# EAGLE design blender (EAGLE 7.2.0)
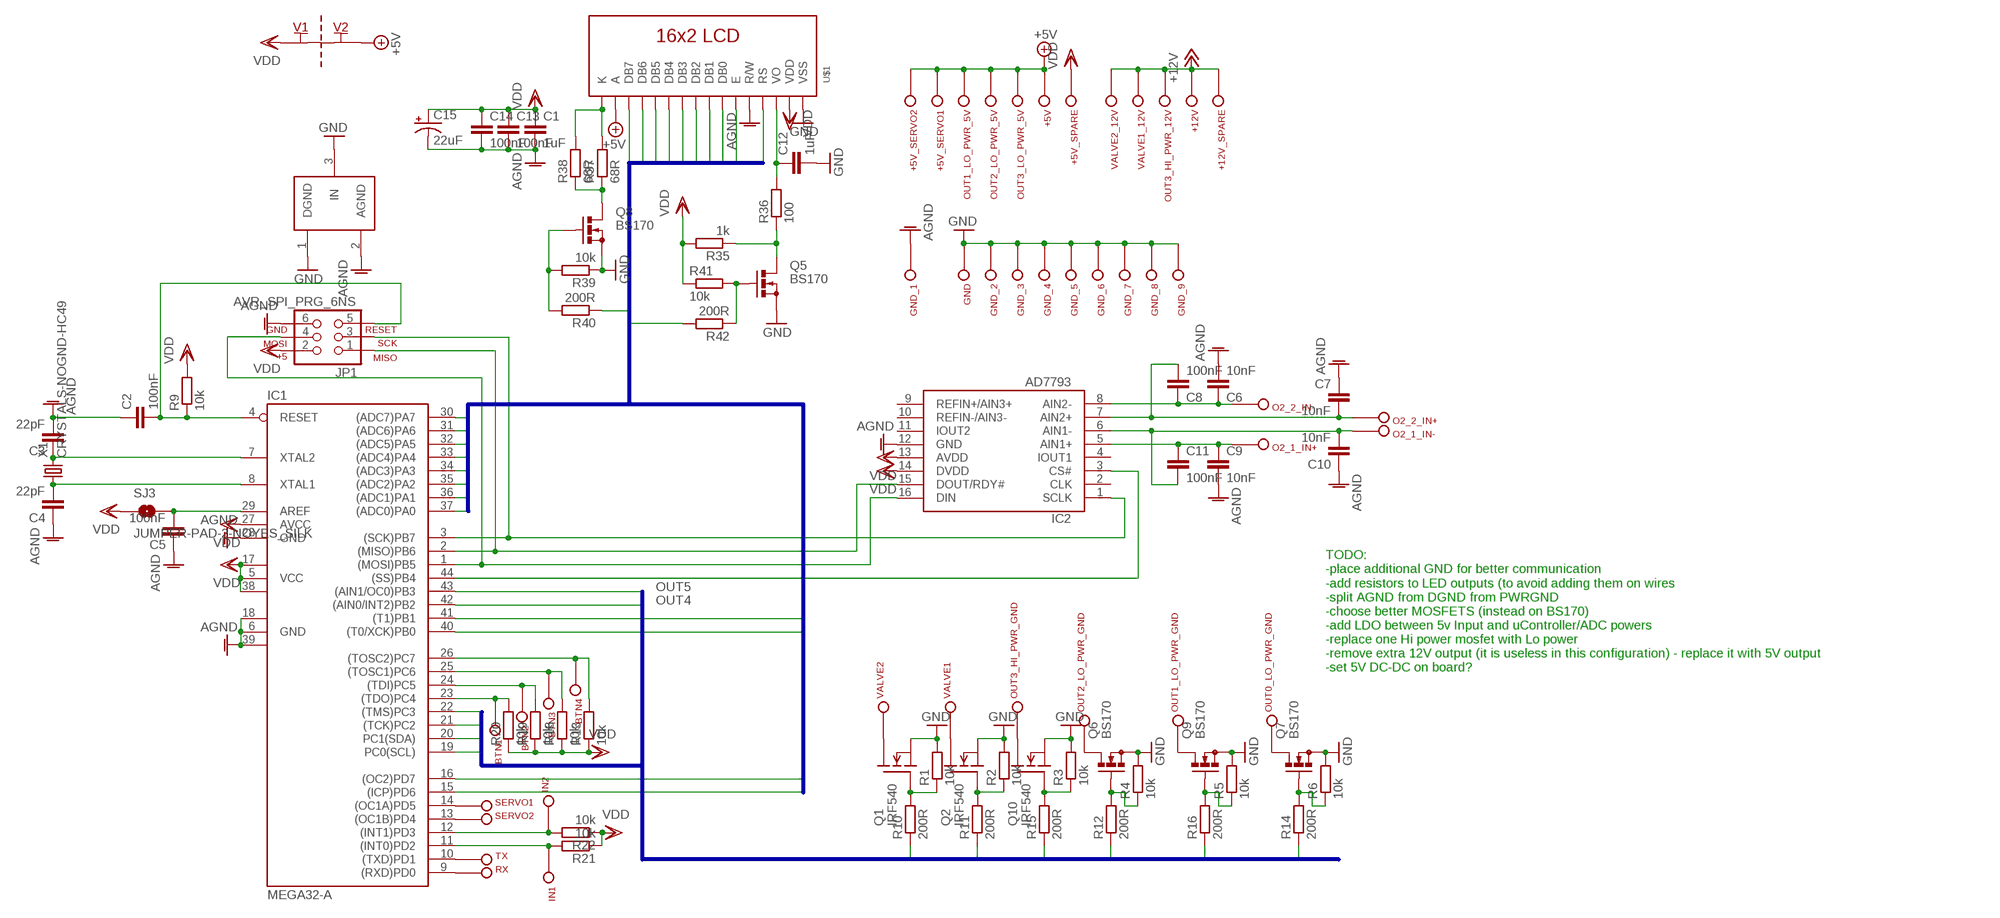
[diagram p0: schematic, sheet 1]

## Parts
+5V  PIN  [PIN]
+5V_SERVO1  PIN  [PIN]
+5V_SERVO2  PIN  [PIN]
+5V_SPARE  PIN  [PIN]
+12V  PIN  [PIN]
+12V_SPARE  PIN  [PIN]
BTN1  PIN  [PIN]
BTN2  PIN  [PIN]
BTN3  PIN  [PIN]
BTN4  PIN  [PIN]
C1  1uF  C-EUC0603  [C0603]
C2  100nF  C-EUC0603  [C0603]
C3  22pF  C-EUC0603  [C0603]
C4  22pF  C-EUC0603  [C0603]
C5  100nF  C-EUC0603  [C0603]
C6  10nF  C-EUC0603  [C0603]
C7  10nF  C-EUC0603  [C0603]
C8  100nF  C-EUC0603  [C0603]
C9  10nF  C-EUC0603  [C0603]
C10  10nF  C-EUC0603  [C0603]
C11  100nF  C-EUC0603  [C0603]
C12  1uF  C-EUC0603  [C0603]
C13  100nF  C-EUC0603  [C0603]
C14  100nF  C-EUC0603  [C0603]
C15  22uF  CAP_POL7343  [EIA7343]
GND  PIN  [PIN]
GND_1  PIN  [PIN]
GND_2  PIN  [PIN]
GND_3  PIN  [PIN]
GND_4  PIN  [PIN]
GND_5  PIN  [PIN]
GND_6  PIN  [PIN]
GND_7  PIN  [PIN]
GND_8  PIN  [PIN]
GND_9  PIN  [PIN]
IC1  MEGA32-A  [TQFP44]
IC2  AD7793  [TSSOP16]
IN1  PIN  [PIN]
IN2  PIN  [PIN]
JP1  AVR_SPI_PRG_6NS  [2X3-NS]
O2_1_IN+  PIN  [PIN]
O2_1_IN-  PIN  [PIN]
O2_2_IN+  PIN  [PIN]
O2_2_IN-  PIN  [PIN]
OUT0_LO_PWR_GND  PIN  [PIN]
OUT1_LO_PWR_5V  PIN  [PIN]
OUT1_LO_PWR_GND  PIN  [PIN]
OUT2_LO_PWR_5V  PIN  [PIN]
OUT2_LO_PWR_GND  PIN  [PIN]
OUT3_HI_PWR_12V  PIN  [PIN]
OUT3_HI_PWR_GND  PIN  [PIN]
OUT3_LO_PWR_5V  PIN  [PIN]
Q1  IRF540  [TO220]
Q2  IRF540  [TO220]
Q5  BS170  [SOT54E]
Q6  BS170  [SOT54E]
Q7  BS170  [SOT54E]
Q8  BS170  [SOT54E]
Q9  BS170  [SOT54E]
Q10  IRF540  [TO220]
R1  10k  R-EU_R0603  [R0603]
R2  10k  R-EU_R0603  [R0603]
R3  10k  R-EU_R0603  [R0603]
R4  10k  R-EU_R0603  [R0603]
R5  10k  R-EU_R0603  [R0603]
R6  10k  R-EU_R0603  [R0603]
R9  10k  R-EU_R0603  [R0603]
R10  200R  R-EU_R0603  [R0603]
R11  200R  R-EU_R0603  [R0603]
R12  200R  R-EU_R0603  [R0603]
R13  10k  R-EU_R0603  [R0603]
R14  200R  R-EU_R0603  [R0603]
R15  200R  R-EU_R0603  [R0603]
R16  200R  R-EU_R0603  [R0603]
R18  10k  R-EU_R0603  [R0603]
R19  10k  R-EU_R0603  [R0603]
R20  10k  R-EU_R0603  [R0603]
R21  10k  R-EU_R0603  [R0603]
R22  10k  R-EU_R0603  [R0603]
R35  1k  R-EU_R0603  [R0603]
R36  100  R-EU_R0603  [R0603]
R37  68R  R-EU_R1206  [R1206]
R38  68R  R-EU_R1206  [R1206]
R39  10k  R-EU_R0603  [R0603]
R40  200R  R-EU_R0603  [R0603]
R41  10k  R-EU_R0603  [R0603]
R42  200R  R-EU_R0603  [R0603]
RX  PIN  [PIN]
SERVO1  PIN  [PIN]
SERVO2  PIN  [PIN]
SJ3  JUMPER-PAD-2-NOYES_SILK  [PAD-JUMPER-2-NO_YES_SILK]
TX  PIN  [PIN]
U$1  1602L  [1602L]
U$2  SUPPLY_CONNECT  [2PT_GND_TIE]
U$3  GND_CONNECT  [GND_CONNECT]
VALVE1  PIN  [PIN]
VALVE1_12V  PIN  [PIN]
VALVE2  PIN  [PIN]
VALVE2_12V  PIN  [PIN]
X1  CRYSTALS-NOGND-HC49  [HC49]

## Nets
+5V [PWR_5V]: +5V.P$1(P) +5V_SERVO1.P$1(P) +5V_SERVO2.P$1(P) OUT1_LO_PWR_5V.P$1(P) OUT2_LO_PWR_5V.P$1(P) OUT3_LO_PWR_5V.P$1(P) U$1.P$15(A) U$2.P$2
+12V [PWR_12V]: +12V.P$1(P) +12V_SPARE.P$1(P) OUT3_HI_PWR_12V.P$1(P) VALVE1_12V.P$1(P) VALVE2_12V.P$1(P)
AGND [PWR]: C1.2 C2.1 C3.2 C4.1 C5.1 C6.2 C7.1 C9.2 C10.1 C13.2 C14.2 C15.C(-) GND_1.P$1(P) IC1.6(GND) IC1.18(GND1) IC1.28(GND) IC1.39(GND2) IC2.12(GND) JP1.6 U$1.P$5(R/W) U$3.2(AGND)
BACKLIGHT: IC1.16((OC2)PD7) R40.1
CONTRAST: IC1.15((ICP)PD6) R42.2
DB0: IC1.37((ADC0)PA0) U$1.P$7(DB0)
DB1: IC1.36((ADC1)PA1) U$1.P$8(DB1)
DB2: IC1.35((ADC2)PA2) U$1.P$9(DB2)
DB3: IC1.34((ADC3)PA3) U$1.P$10(DB3)
DB4: IC1.33((ADC4)PA4) U$1.P$11(DB4)
DB5: IC1.32((ADC5)PA5) U$1.P$12(DB5)
DB6: IC1.31((ADC6)PA6) U$1.P$13(DB6)
DB7: IC1.30((ADC7)PA7) U$1.P$14(DB7)
E: IC1.40((T0/XCK)PB0) U$1.P$6(E)
GND [PWR_5V]: C12.2 GND.P$1(P) GND_2.P$1(P) GND_3.P$1(P) GND_4.P$1(P) GND_5.P$1(P) GND_6.P$1(P) GND_7.P$1(P) GND_8.P$1(P) GND_9.P$1(P) Q1.3(S) Q2.3(S) Q5.S Q6.S Q7.S Q8.S Q9.S Q10.3(S) R1.2 R2.2 R3.2 R4.2 R5.2 R6.2 R39.1 U$1.P$1(VSS) U$3.1(DGND) U$3.3(IN)
N$4: Q5.D R35.1 R36.1
N$5: C12.1 R36.2 U$1.P$3(VO)
N$6: Q8.D R37.1 R38.1
N$7: R37.2 R38.2 U$1.P$16(K)
N$8: Q8.G R39.2 R40.2
N$12: IC1.1((MOSI)PB5) IC2.16(DIN) JP1.4
N$13: IC1.2((MISO)PB6) IC2.15(DOUT/RDY#) JP1.1
N$14: IC1.3((SCK)PB7) IC2.1(SCLK) JP1.3
N$15: IC1.44((SS)PB4) IC2.3(CS#)
N$23: C2.2 IC1.4(RESET) JP1.5 R9.1
N$24: Q5.G R41.2 R42.1
N$25: C3.1 IC1.7(XTAL2) X1.2
N$26: C4.2 IC1.8(XTAL1) X1.1
N$27: Q1.1(G) R1.1 R10.2
N$28: Q2.1(G) R2.1 R11.2
N$29: Q10.1(G) R3.1 R15.2
N$30: BTN3.P$1(P) IC1.25((TOSC1)PC6) R18.2
N$31: Q7.G R6.1 R14.2
N$32: Q6.G R4.1 R12.2
N$33: Q9.G R5.1 R16.2
N$39: C5.2 IC1.29(AREF) SJ3.2
N$40: IC1.12((INT1)PD3) IN2.P$1(P) R22.2
N$41: IC1.11((INT0)PD2) IN1.P$1(P) R21.2
N$42: BTN4.P$1(P) IC1.26((TOSC2)PC7) R13.2
N$43: BTN2.P$1(P) IC1.24((TDI)PC5) R19.2
N$44: BTN1.P$1(P) IC1.23((TDO)PC4) R20.2
N$45: IC1.9((RXD)PD0) RX.P$1(P)
N$46: IC1.10((TXD)PD1) TX.P$1(P)
N$47: IC1.14((OC1A)PD5) SERVO1.P$1(P)
N$48: IC1.13((OC1B)PD4) SERVO2.P$1(P)
N$49 [PWR_12V]: Q2.2(D) VALVE1.P$1(P)
N$50 [PWR_12V]: Q1.2(D) VALVE2.P$1(P)
N$51 [PWR_12V]: OUT3_HI_PWR_GND.P$1(P) Q10.2(D)
N$52: OUT0_LO_PWR_GND.P$1(P) Q7.D
N$53: OUT1_LO_PWR_GND.P$1(P) Q9.D
N$54: OUT2_LO_PWR_GND.P$1(P) Q6.D
N$55: C10.2 C11.2 IC2.6(AIN1-) O2_1_IN-.P$1(P)
N$59: C7.2 C8.2 IC2.7(AIN2+) O2_2_IN+.P$1(P)
N$60: C6.1 C8.1 IC2.8(AIN2-) O2_2_IN-.P$1(P)
N$64: C9.1 C11.1 IC2.5(AIN1+) O2_1_IN+.P$1(P)
OUT0: IC1.19(PC0(SCL)) R14.1
OUT1: IC1.20(PC1(SDA)) R16.1
OUT2: IC1.21((TCK)PC2) R12.1
OUT3: IC1.22((TMS)PC3) R15.1
OUT4: IC1.42((AIN0/INT2)PB2) R11.1
OUT5: IC1.43((AIN1/OC0)PB3) R10.1
RS: IC1.41((T1)PB1) U$1.P$4(RS)
VDD [PWR]: +5V_SPARE.P$1(P) C1.1 C13.1 C14.1 C15.A(+) IC1.5(VCC) IC1.17(VCC1) IC1.27(AVCC) IC1.38(VCC2) IC2.13(AVDD) IC2.14(DVDD) JP1.2 R9.2 R13.1 R18.1 R19.1 R20.1 R21.1 R22.1 R35.2 R41.1 SJ3.1 U$1.P$2(VDD) U$2.P$1
Unconnected: IC2.2(CLK) IC2.4(IOUT1) IC2.9(REFIN+/AIN3+) IC2.10(REFIN-/AIN3-) IC2.11(IOUT2)

## Buses
DB[0..7],E,RS,BACKLIGHT,CONTRAST
OUT[0..5]

## Notes on the sheet
- TODO:
  -place additional GND for better communication
  -add resistors to LED outputs (to avoid adding them on wires
  -split AGND from DGND from PWRGND
  -choose better MOSFETS (instead on BS170)
  -add LDO between 5v Input and uController/ADC powers
  -replace one Hi power mosfet with Lo power
  -remove extra 12V output (it is useless in this configuration) - replace it with 5V output
  -set 5V DC-DC on board?

## Library data of the parts
+5V +5V_SERVO1 +5V_SERVO2 +5V_SPARE +12V +12V_SPARE BTN1-BTN4 GND GND_1-GND_9 IN1 IN2 O2_1_IN+ O2_1_IN- O2_2_IN+ O2_2_IN- OUT0_LO_PWR_GND OUT1_LO_PWR_5V OUT1_LO_PWR_GND OUT2_LO_PWR_5V OUT2_LO_PWR_GND OUT3_HI_PWR_12V OUT3_HI_PWR_GND OUT3_LO_PWR_5V RX SERVO1 SERVO2 TX VALVE1 VALVE1_12V VALVE2 VALVE2_12V = pin:PIN
C1-C14 = resistor:C-EU: CAPACITOR, European symbol
C15 = SparkFun-Capacitors:CAP_POL: Capacitor Polarized These are standard SMD and PTH capacitors. Normally 10uF, 47uF, and 100uF in electrolytic and tantalum varieties. Always verify the external diameter of the through hole cap, it varies with capacity, voltage, and manufacturer. The EIA devices should be standard.; PROD_ID: CAP-08702
IC1 = atmel:MEGA32: MICROCONTROLLER 32 Kbytes FLASH 2 Kbytes SRAM 1 Kbytes EEPROM USART 8-channel 10 bit ADC Source: www.atmel.com .. doc2503.pdf; MPN: ATMEGA32-16AU; OC_FARNELL: 9171274; OC_NEWARK: 69K6677
IC2 = ad:AD7793: 3-Channel, Low Noise, Low Power, 24-Bit Sigma-Delta ADC with On-Chip In-Amp and Reference
JP1 = SparkFun-Connectors:AVR_SPI_PRG_6: AVR ISP 6 Pin This is the reduced ISP connector for AVR programming. Common on Arduino. This footprint will take up less PCB space and can be used with a 10-pin to 6-pin adapter such as SKU: BOB-08508 **Special note about "TEST_POINT" package. The stop mask is on the top side, so if you want your programming test points to be on the bottom of your board, make sure to place this package on the bottom side of the board. This also ensure that the orientation to program from the bottom side will be correct.
Q1 Q2 Q10 = transistor-fet:IRF540: N-Channel Enhancement MOSFET (HEXFET); 100V; 28A; 0,077Ohm
Q5-Q9 = transistor-small-signal:BS170: N-CHANNEL MOS FET
R1-R6 R9-R16 R18-R22 R35-R42 = resistor:R-EU_: RESISTOR, European symbol
SJ3 = SparkFun-Passives:JUMPER-PAD-2-NO
U$1 = 1602:1602L
U$2 = SparkFun-Passives:SUPPLY_CONNECT
U$3 = SparkFun-Passives:GND_CONNECT: Use to make a connection of multiple grounds in only one place.
X1 = IQD-Frequency-Products:CRYSTALS-NOGND: CRYSTALS CAN NOT GROUNDED

## Net classes
1 PWR_5V: width 1.5 mm, drill 1 mm
2 PWR_12V: width 2 mm, drill 1 mm
3 PWR: width 0.4 mm, drill 0.6 mm

## Board
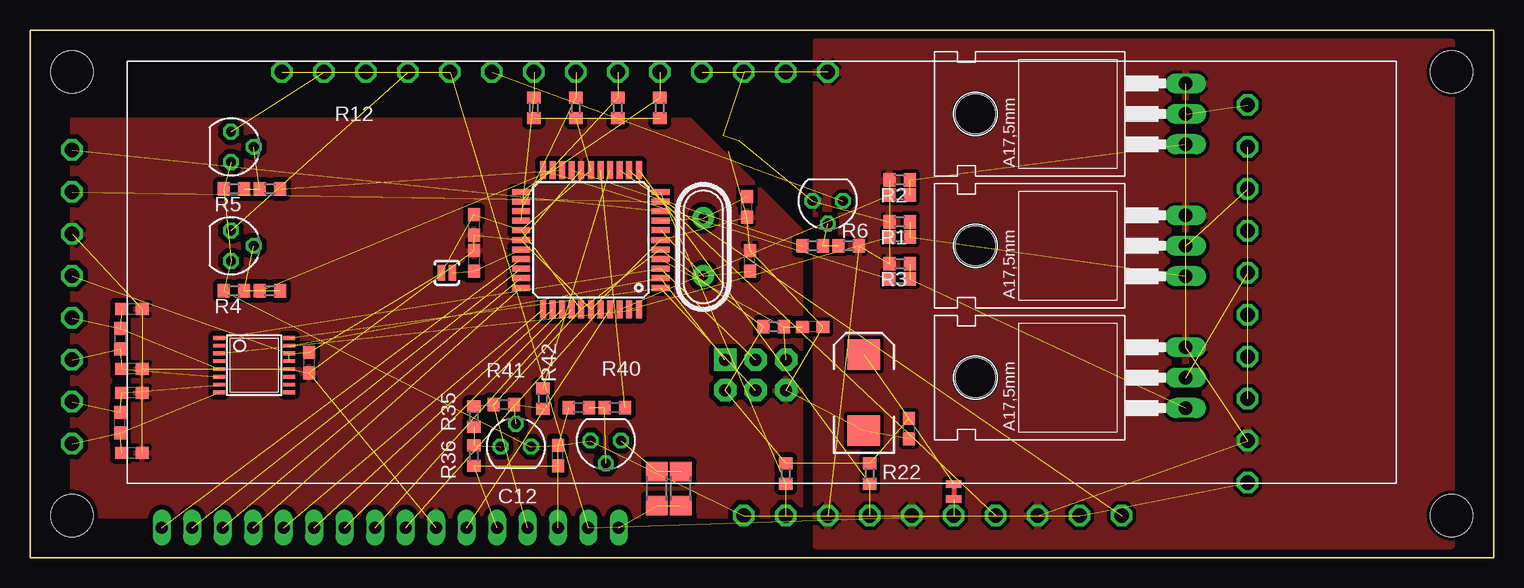
[diagram p1: board, top side]
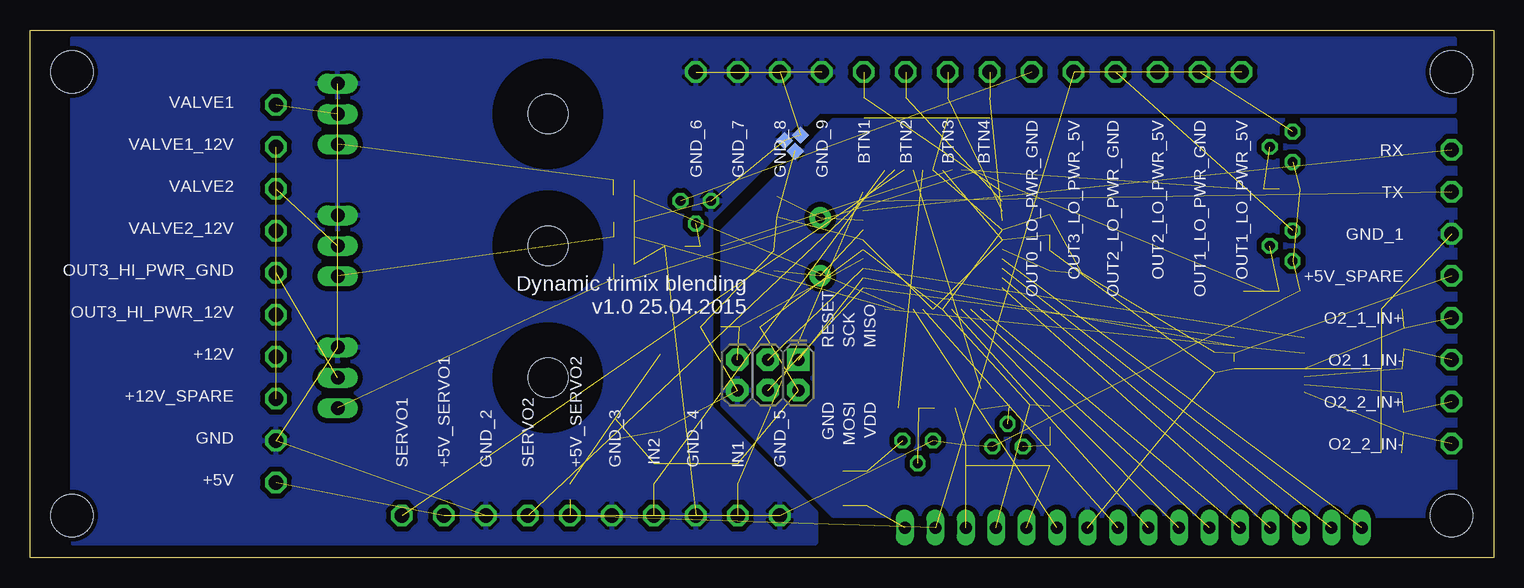
[diagram p2: board, bottom side, seen from below]

Size 122 x 44 mm. Coordinates in mm from the lower left corner, seen from the top.
Outline: 0,0 122,0 122,44 0,44 0,0
Copper layers (1*16): Top 0.035mm / dielectric 1.5mm / Bottom 0.035mm
Design rules "SeeedStudio_2layer_DRU_no_angle_20140221": minimum track width 6mil, minimum drill 12mil, track to track 6mil, track to pad 6mil, pad to pad 6mil, via to via 6mil, smd to smd 0mil, copper to edge 10mil, drill to drill 10mil, minimum pad ring 10mil, minimum via ring 6mil, stop-mask expansion 2mil, vias tented up to drill 100mil, thermal gap 10mil

### Footprints (pad centres in the part's own frame; a part is rotated, then mirrored left to right if it is on the bottom)
PIN = drill 1.2 pad 1.676 octagon: P$1 0,0
C0603 = smd 1.1 x 1: 1 -0.85,0; 2 0.85,0
EIA7343 = smd 2.55 x 2.7: A 3.17,0; C -3.17,0
TQFP44 = smd 1.5 x 0.5: 1 -5.8,4; 2 -5.8,3.2; 3 -5.8,2.4; 4 -5.8,1.6; 5 -5.8,0.8; 6 -5.8,0; 7 -5.8,-0.8; 8 -5.8,-1.6; 9 -5.8,-2.4; 10 -5.8,-3.2; 11 -5.8,-4; 23 5.8,-4; 24 5.8,-3.2; 25 5.8,-2.4; 26 5.8,-1.6; 27 5.8,-0.8; 28 5.8,0; 29 5.8,0.8; 30 5.8,1.6; 31 5.8,2.4; 32 5.8,3.2; 33 5.8,4 | smd 0.5 x 1.5: 12 -4,-5.8; 13 -3.2,-5.8; 14 -2.4,-5.8; 15 -1.6,-5.8; 16 -0.8,-5.8; 17 0,-5.8; 18 0.8,-5.8; 19 1.6,-5.8; 20 2.4,-5.8; 21 3.2,-5.8; 22 4,-5.8; 34 4,5.8; 35 3.2,5.8; 36 2.4,5.8; 37 1.6,5.8; 38 0.8,5.8; 39 0,5.8; 40 -0.8,5.8; 41 -1.6,5.8; 42 -2.4,5.8; 43 -3.2,5.8; 44 -4,5.8
TSSOP16 = smd 0.305 x 0.991: 1 -2.275,-2.918; 2 -1.625,-2.918; 3 -0.975,-2.918; 4 -0.325,-2.918; 5 0.325,-2.918; 6 0.975,-2.918; 7 1.625,-2.918; 8 2.275,-2.918; 9 2.275,2.918; 10 1.625,2.918; 11 0.975,2.918; 12 0.325,2.918; 13 -0.325,2.918; 14 -0.975,2.918; 15 -1.625,2.918; 16 -2.275,2.918
2X3-NS = drill 1.016 pad 1.88 square: 1 -2.54,-1.27 | drill 1.016 pad 1.88 octagon: 2 -2.54,1.27; 3 0,-1.27; 4 0,1.27; 5 2.54,-1.27; 6 2.54,1.27
TO220 = drill 1.118 long: 1 -2.54,-6.35; 2 0,-6.35; 3 2.54,-6.35 | hole 3.302: 0,11.176
SOT54E = drill 0.813 octagon: D -1.27,0; G 0,1.905; S 1.27,0
R0603 = smd 1 x 1.1: 1 -0.85,0; 2 0.85,0
R1206 = smd 1.6 x 1.803: 1 -1.422,0; 2 1.422,0
PAD-JUMPER-2-NO_YES_SILK = smd 0.635 x 1.27: 1 -0.45,0; 2 0.45,0
1602L = drill 1 long: P$1 -17,-19.5; P$2 -19.54,-19.5; P$3 -22.08,-19.5; P$4 -24.62,-19.5; P$5 -27.16,-19.5; P$6 -29.7,-19.5; P$7 -32.24,-19.5; P$8 -34.78,-19.5; P$9 -37.32,-19.5; P$10 -39.86,-19.5; P$11 -42.4,-19.5; P$12 -44.94,-19.5; P$13 -47.48,-19.5; P$14 -50.02,-19.5; P$15 -14.46,-19.5; P$16 -11.92,-19.5 | hole 3.5: -57.5,-18.5; 57.5,-18.5; 57.5,18.5; -57.5,18.5
2PT_GND_TIE = smd 1.27 x 0.635: P$1 0,0.635; P$2 0,-0.635
GND_CONNECT = smd 1.016 x 1.016: 1 -1.016,0; 2 -1.016,-1.27; 3 0.254,-0.635
HC49 = drill 0.813 pad 1.8: 1 -2.413,0; 2 2.413,0

### Placement (x,y rotation side)
+5V  101.5,6.25 180 bottom
+5V_SERVO1  87.5,3.5 90 bottom
+5V_SERVO2  77,3.5 90 bottom
+5V_SPARE  3.5,23.5 180 bottom
+12V  101.5,16.75 180 bottom
+12V_SPARE  101.5,13.25 180 bottom
BTN1  52.5,40.5 270 bottom
BTN2  49,40.5 270 bottom
BTN3  45.5,40.5 270 bottom
BTN4  42,40.5 270 bottom
C1  73.25,10.75 270 top
C2  65.25,19.25 180 top
C3  60,24.75 90 top
C4  59.75,29.25 90 top
C5  37,24.75 270 top
C6  8.5,8.75 0 top
C7  8.5,13.75 180 top
C8  7.5,11.25 90 top
C9  8.5,20.75 0 top
C10  8.5,15.75 180 top
C11  7.5,18.25 270 top
C12  44,8.5 90 top
C13  37,27.75 270 top
C14  23.25,16.25 270 top
C15  69.5,13.75 90 top
GND  101.5,9.75 180 bottom
GND_1  3.5,27 180 bottom
GND_2  84,3.5 90 bottom
GND_3  73.5,3.5 90 bottom
GND_4  66.5,3.5 90 bottom
GND_5  59.5,3.5 90 bottom
GND_6  66.5,40.5 270 bottom
GND_7  63,40.5 270 bottom
GND_8  59.5,40.5 270 bottom
GND_9  56,40.5 270 bottom
IC1  46.75,26.5 180 top
IC2  18.69,16.04 270 top
IN1  63,3.5 90 bottom
IN2  70,3.5 90 bottom
JP1  60.49,15.22 180 bottom
O2_1_IN+  3.5,20 180 bottom
O2_1_IN-  3.5,16.5 180 bottom
O2_2_IN+  3.5,13 180 bottom
O2_2_IN-  3.5,9.5 180 bottom
OUT0_LO_PWR_GND  38.5,40.5 270 bottom
OUT1_LO_PWR_5V  21,40.5 270 bottom
OUT1_LO_PWR_GND  24.5,40.5 270 bottom
OUT2_LO_PWR_5V  28,40.5 270 bottom
OUT2_LO_PWR_GND  31.5,40.5 270 bottom
OUT3_HI_PWR_12V  101.5,20.25 180 bottom
OUT3_HI_PWR_GND  101.5,23.75 180 bottom
OUT3_LO_PWR_5V  35,40.5 270 bottom
Q1  90,26 90 top
Q2  90,37 90 top
Q5  40.5,9.25 0 top
Q6  16.75,26 270 top
Q7  66.5,29.75 180 top
Q8  48,9.75 180 top
Q9  16.75,34.25 270 top
Q10  90,15 90 top
R1  72.5,28 180 top
R2  72.5,31.5 180 top
R3  72.5,24.5 180 top
R4  17,22.25 180 top
R5  17,30.75 180 top
R6  68.25,26 0 top
R9  62,19.25 180 top
R10  72.5,26.75 0 top
R11  72.5,30.25 0 top
R12  20,22.25 0 top
R13  42,37.5 90 top
R14  65.25,26 0 top
R15  72.5,23.25 0 top
R16  20,30.75 180 top
R18  45.5,37.5 90 top
R19  49,37.5 90 top
R20  52.5,37.5 90 top
R21  63,7 270 top
R22  70,7 270 top
R35  37,11.75 90 top
R36  37,8.5 270 top
R37  52.25,5.75 270 top
R38  54.25,5.75 270 top
R39  45.75,12.5 0 top
R40  48.75,12.5 180 top
R41  39.5,12.75 0 top
R42  42.75,13.25 90 top
RX  3.5,34 180 bottom
SERVO1  91,3.5 90 bottom
SERVO2  80.5,3.5 90 bottom
SJ3  34.75,23.75 0 top
TX  3.5,30.5 180 bottom
U$1  61,22 0 top
U$2  77,5.5 0 top
U$3  58.4,35.5 45 bottom
VALVE1  101.5,37.75 180 bottom
VALVE1_12V  101.5,34.25 180 bottom
VALVE2  101.5,30.75 180 bottom
VALVE2_12V  101.5,27.25 180 bottom
X1  56.13,25.91 270 top

### Tracks (layer width: path | path; a pad name or v marks a point on that pad's centre or on a via)
+5V  (7 unrouted)
+12V  (4 unrouted)
AGND  (20 unrouted)
  pour Bottom (isolate 0.406): 3.25,3.5 55,3.5 64.25,12.75 64.25,27.25 55,36.5 3.25,36.5
  pour Top (isolate 0.406): 3.5,3.5 64.25,3.5 64.25,27.25 55,36.5 3.5,36.5
BACKLIGHT  (1 unrouted)
CONTRAST  (1 unrouted)
DB0  (1 unrouted)
DB1  (1 unrouted)
DB2  (1 unrouted)
DB3  (1 unrouted)
DB4  (1 unrouted)
DB5  (1 unrouted)
DB6  (1 unrouted)
DB7  (1 unrouted)
E  (1 unrouted)
GND  (27 unrouted)
  pour Bottom (isolate 0.406): 118.5,1.25 56.5,1.25 56.5,3.75 65.25,12.5 65.25,28.25 56.25,37.25 3.25,37.25 3.25,43.25 118.5,43.25
  pour Top (isolate 0.305): 65.5,1 118.5,1 118.5,43 65.5,43
N$4  (2 unrouted)
N$5  (2 unrouted)
N$6  (2 unrouted)
N$7  (2 unrouted)
N$8  (2 unrouted)
N$12  (2 unrouted)
N$13  (2 unrouted)
N$14  (2 unrouted)
N$15  (1 unrouted)
N$23  (3 unrouted)
N$24  (2 unrouted)
N$25  (2 unrouted)
N$26  (2 unrouted)
N$27  (2 unrouted)
N$28  (2 unrouted)
N$29  (2 unrouted)
N$30  (2 unrouted)
N$31  (2 unrouted)
N$32  (2 unrouted)
N$33  (2 unrouted)
N$39  (2 unrouted)
N$40  (2 unrouted)
N$41  (2 unrouted)
N$42  (2 unrouted)
N$43  (2 unrouted)
N$44  (2 unrouted)
N$45  (1 unrouted)
N$46  (1 unrouted)
N$47  (1 unrouted)
N$48  (1 unrouted)
N$49  (1 unrouted)
N$50  (1 unrouted)
N$51  (1 unrouted)
N$52  (1 unrouted)
N$53  (1 unrouted)
N$54  (1 unrouted)
N$55  (3 unrouted)
N$59  (3 unrouted)
N$60  (3 unrouted)
N$64  (3 unrouted)
OUT0  (1 unrouted)
OUT1  (1 unrouted)
OUT2  (1 unrouted)
OUT3  (1 unrouted)
OUT4  (1 unrouted)
OUT5  (1 unrouted)
RS  (1 unrouted)
VDD  (23 unrouted)

### Text on the board
bNames: Dynamic trimix blending / v1.0 25.04.2015 | MISO | SCK | RESET | VDD | MOSI | GND